# Altium schematic sheet ir_distance_display.SchDoc
size A4; DocumentNumber: 1; Revision: 0.1; SheetNumber: 1; SheetTotal: 1; HTL_Gruppe: 5; HTL_Klasse: 3AHEL; HTL_Zusaetzlicher_Titel: Empfänger und Anzeige; HTL_Schueler_Name: Hannah Purner, Philipp Doná; PageSetup: Record=PageOptions|CenterHorizontal=True|CenterVertical=True|PrintScale=1.00|XCorrection=1.00|YCorrection=1.00|PrintKind=0|BorderSize=5000000|LeftOffset=0|BottomOffset=0|Orientation=2|PaperLength=1000|PaperWidth=1000|Scale=100|PaperSource=7|PrintQuality=-4|MediaType=1|DitherType=10|PaperKind=A4|PrintScaleMode=1; HTL_Projektname: IR-DIstanz-Indikator; HTL_Dokumentenart: Schaltplan; HTL_Dokumentenstatus: Entwurf; SPICEModelCacheWMBXHUEL: <root> / <DocumentId>WMBXHUEL</DocumentId> / <CacheFrame Number="0"> / <Model Name="lm324" Kind="CKT"> / <Text>*////////////////////////////////////////////////////////// / *LM324 Low Power Quad OPERATIONAL AMPLIFIER MACRO-MODEL / *////////////////////////////////////////////////////////// / * / * connections:      non-inverting input / *                   |   inverting input / *                   |   |   positive power supply / *                   |   |   |   negative power supply / *                   |   |   |   |   output / *                   |   |   |   |   | / *                   |   |   |   |   | / .SUBCKT LM324       1   2  99  50  28 / * / * PINOUT ORDER +IN -IN V+ V- OUT / * / * / *Features: / *Eliminates need for dual supplies / *Large DC voltage gain =             100dB / *High bandwidth =                     1MHz / *Low input offset voltage =            2mV / *Wide supply range =        +-1.5V to +-16V / * / *NOTE: Model is for single device only and simulated / *      supply current is 1/4 of total device current. / *      Output crossover distortion with dual supplies / *      is not modeled. / * / ****************INPUT STAGE************** / * / IOS 2 1 5N / *^Input offset current / R1 1 3 500K / R2 3 2 500K / I1 99 4 100U / R3 5 50 517 / R4 6 50 517 / Q1 5 2 4 QX / Q2 6 7 4 QX / *Fp2=1.2 MHz / C4 5 6 128.27P / * / ***********COMMON MODE EFFECT*********** / * / I2 99 50 75U / *^Quiescent supply current / EOS 7 1 POLY(1) 16 49 2E-3 1 / *Input offset voltage.^ / R8 99 49 60K / R9 49 50 60K / * / *********OUTPUT VOLTAGE LIMITING******** / V2 99 8 1.63 / D1 9 8 DX / D2 10 9 DX / V3 10 50 .635 / * / **************SECOND STAGE************** / * / EH 99 98 99 49 1 / G1 98 9 POLY(1) 5 6 0 9.8772E-4 0 .3459 / *Fp1=7.86 Hz / R5 98 9 101.2433MEG / C3 98 9 200P / * / ***************POLE STAGE*************** / * / *Fp=2 MHz / G3 98 15 9 49 1E-6 / R12 98 15 1MEG / C5 98 15 7.9577E-14 / * / *********COMMON-MODE ZERO STAGE********* / * / *Fpcm=10 KHz / G4 98 16 3 49 5.6234E-8 / L2 98 17 15.9M / R13 17 16 1K / * / **************OUTPUT STAGE************** / * / F6 50 99 POLY(1) V6 300U 1 / E1 99 23 99 15 1 / R16 24 23 17.5 / D5 26 24 DX / V6 26 22 .63V / R17 23 25 17.5 / D6 25 27 DX / V7 22 27 .63V / V5 22 21 0.27V / D4 21 15 DX / V4 20 22 0.27V / D3 15 20 DX / L3 22 28 500P / RL3 22 28 100K / * / ***************MODELS USED************** / * / .MODEL DX D(IS=1E-15) / .MODEL QX PNP(BF=1.111E3) / * / .ENDS</Text> / </Model> / <Model Name="led_grn_yel" Kind="MDL"> / <Text>*Typ RED,GREEN,YELLOW,AMBER GaAs LED: Vf=2.1V Vr=4V If=40mA trr=3uS / *LED Pinout: 1=A, 2=K / .MODEL LED_GRN_YEL D (IS=93.1P RS=42M N=4.61 BV=4 IBV=10U / + CJO=2.97P VJ=.75 M=.333 TT=4.32U)</Text> / </Model> / <Model Name="led_red" Kind="MDL"> / <Text>*Typ RED GaAs LED: Vf=1.7V Vr=4V If=40mA trr=3uS / *LED Pinout: 1=A, 2=K / .MODEL LED_RED D (IS=93.2P RS=42M N=3.73 BV=4 IBV=10U / + CJO=2.97P VJ=.75 M=.333 TT=4.32U)</Text> / </Model> / <Model Name="qbc547a" Kind="MDL"> / <Text>* / .MODEL QBC547A NPN( / +     IS=1.533E-14 / +     NF=1.002 / +     ISE=7.932E-16 / +     NE=1.436 / +     BF=178.7 / +     IKF=0.1216 / +     VAF=69.7 / +     NR=1.004 / +     ISC=8.305E-14 / +     NC=1.207 / +     BR=8.628 / +     IKR=0.1121 / +     VAR=44.7 / +     RB=1 / +     IRB=1E-06 / +     RBM=1 / +     RE=0.6395 / +     RC=0.6508 / +     XTB=0 / +     EG=1.11 / +     XTI=3 / +     CJE=1.61E-11 / +     VJE=0.4209 / +     MJE=0.3071 / +     TF=4.995E-10 / +     XTF=139 / +     VTF=3.523 / +     ITF=0.7021 / +     PTF=0 / +     CJC=4.388E-12 / +     VJC=0.2 / +     MJC=0.2793 / +     XCJC=0.6193 / +     TR=1E-32 / +     CJS=0 / +     VJS=0.75 / +     MJS=0.333 / +     FC=0.7762 )</Text> / </Model> / <Model Name="led_ir" Kind="MDL"> / <Text>*Typ INFRARED GaAs LED: Vf=1.2V Vr=5V If=40mA trr=3uS / *LED Pinout: 1=A, 2=K / .MODEL LED_IR D (IS=93.5P RS=84M N=2.63 BV=5 IBV=10U / + CJO=2.97P VJ=.75 M=.333 TT=4.32U)</Text> / </Model> / </CacheFrame> / </root>
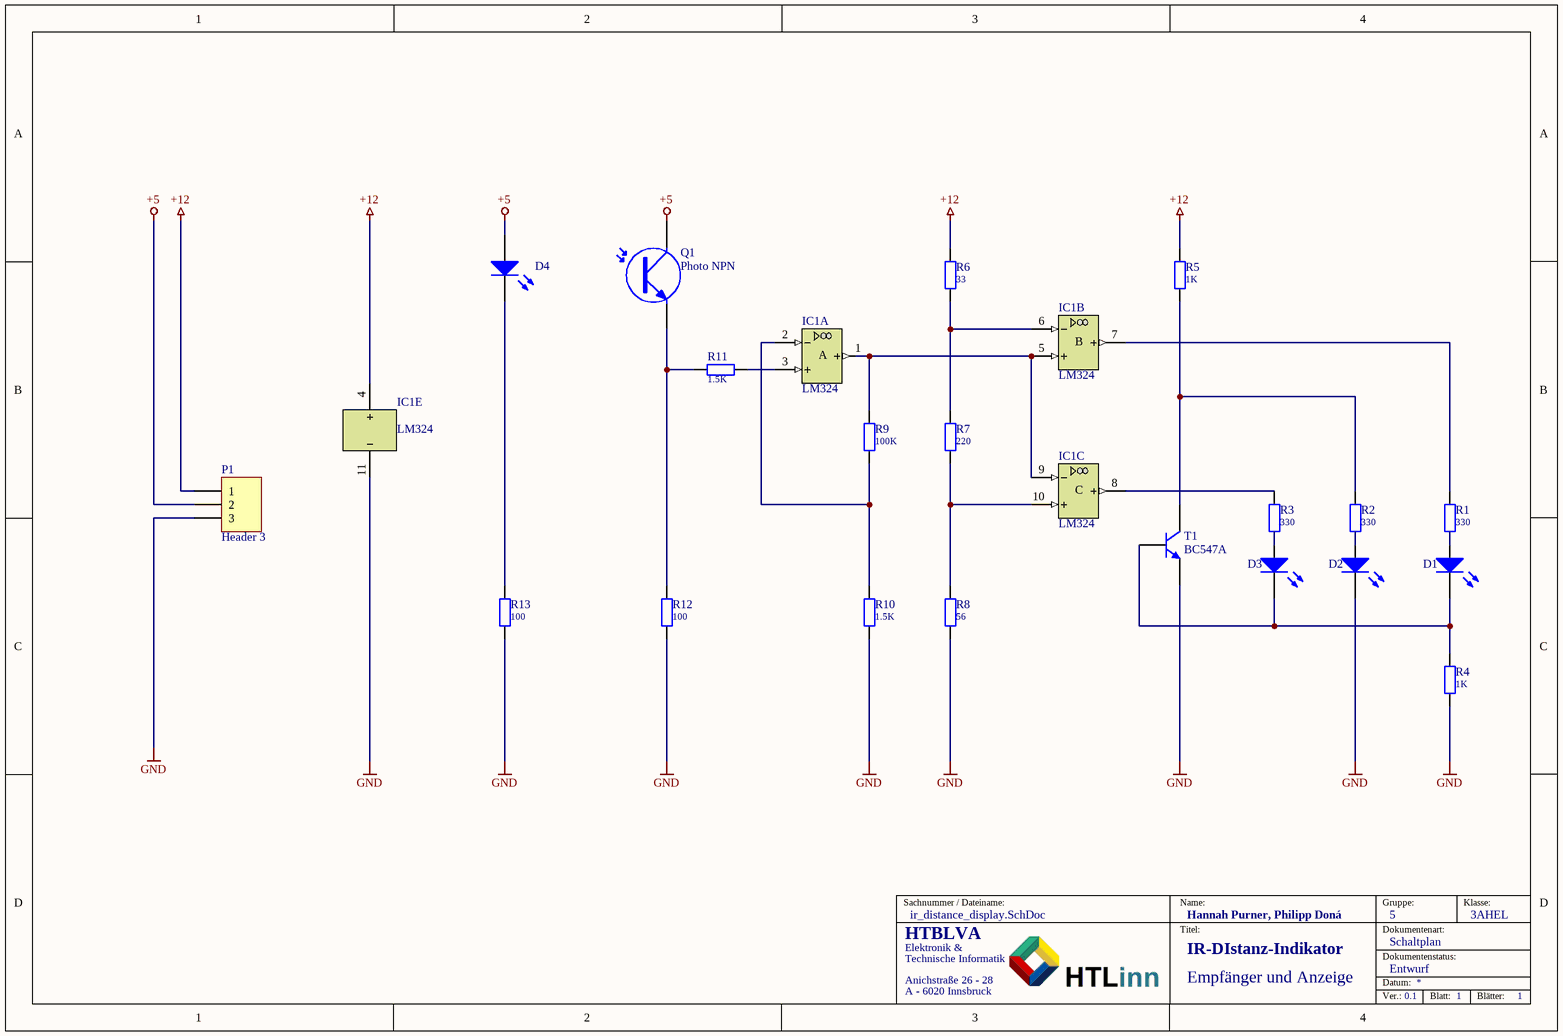
[diagram p0: ir_distance_display.SchDoc]

## Parts
D1  LED GREEN  [LED_5MM - green]  (value not drawn)
D2  LED YELLOW  [LED_5MM - yellow]  (value not drawn)
D3  LED RED  [LED_5MM - red]  (value not drawn)
D4  LED IR  [LED_5MM - clear]  (value not drawn)
IC1  LM324  [DIP14]  (parts A,B,C,E of 5)
P1  Header 3  [HDR1X3]
Q1  Photo NPN  [TO-220_A]
R1  330  [R_0207/RM4]
R2  330  [R_0207/RM4]
R3  330  [R_0207/RM4]
R4  1K  [R_0207/RM4]
R5  1K  [R_0207/RM4]
R6  33  [R_0207/RM4]
R7  220  [R_0207/RM4]
R8  56  [R_0207/RM4]
R9  100K  [R_0207/RM4]
R10  1.5K  [R_0207/RM4]
R11  1.5K  [R_0207/RM4]
R12  100  [R_0207/RM4]
R13  100  [R_0207/RM4]
T1  BC547A  [TO-92A-2]

## Nets
+5: D4.A P1.2 Q1.1(C)
+12: IC1.4(V+) P1.1 R5.1 R6.2
GND: D2.K IC1.11(V-) P1.3 R4.1 R8.1 R10.1 R12.1 R13.1 T1.1(E)
NetD1_A: D1.A R1.2
NetD1_K: D1.K D3.K R4.2 T1.2(B)
NetD2_A: D2.A R2.2
NetD3_A: D3.A R3.2
NetD4_K: D4.K R13.2
NetIC1_1: IC1.1(OUT) IC1.5(IN+) IC1.9(IN-) R9.1
NetIC1_2: IC1.2(IN-) R9.2 R10.2
NetIC1_3: IC1.3(IN+) R11.1
NetIC1_6: IC1.6(IN-) R6.1 R7.2
NetIC1_7: IC1.7(OUT) R1.1
NetIC1_8: IC1.8(OUT) R3.1
NetIC1_10: IC1.10(IN+) R7.1 R8.2
NetQ1_3: Q1.3(E) R11.2 R12.2
NetR2_1: R2.1 R5.2 T1.3(C)

## Notes on the sheet
- Sachnummer / Dateiname:
- Name:
- Gruppe:
- Klasse:
- Elektronik &
- Technische Informatik
- Anichstraße 26 - 28
- HTBLVA
- Titel:
- Datum:
- Dokumentenart:
- Dokumentenstatus:
- A - 6020 Innsbruck
- Ver.:
- Blatt:
- Blätter:
- (in symbol LM324, part A) A
- (in symbol LM324, part B) B
- (in symbol LM324, part C) C

## Library data of the parts
D1 = LED_GREEN: Green GaAs LED (Vf=2.1V, If=40mA); Usage: only permitted for non-commercial purposes at HTL I Innsbruck; SimulationModellSource: Miscellaneous Devices; Published: 21-Feb-2011; LatestRevisionDate: 01-Nov-2013
D2 = LED_YELLOW: Yellow GaAs LED (Vf=2.1V, If=40mA); Usage: only permitted for non-commercial purposes at HTL I Innsbruck; SimulationModellSource: Miscellaneous Devices; Published: 21-Feb-2011; LatestRevisionDate: 01-Nov-2013
D3 = LED_RED: Red GaAs LED (Vf=1.7V, If=40mA); Usage: only permitted for non-commercial purposes at HTL I Innsbruck; SimulationModellSource: Miscellaneous Devices; Published: 21-Feb-2011; LatestRevisionDate: 01-Nov-2013
D4 = LED_IR: Infrared GaAs LED (Vf=1.2V, If=40mA); Usage: only permitted for non-commercial purposes at HTL I Innsbruck; SimulationModellSource: Miscellaneous Devices; Published: 21-Feb-2011; LatestRevisionDate: 01-Nov-2013
IC1 = LM324: Low-Power Quad Operational Amplifier; Usage: only permitted for non-commercial purposes at HTL I Innsbruck; SimulationModellSource: ST Operational Amplifier; Published: 21-Feb-2011; LatestRevisionDate: 31-Oct-2012; Publisher: Michael Kupfner
P1 = Header 3: Header, 3-Pin; LatestRevisionDate: 17-Jul-2002; LatestRevisionNote: Re-released for DXP Platform.; Publisher: Altium Limited
Q1 = Photo NPN: NPN Phototransistor; Published: 24-Mar-1999; LatestRevisionDate: 17-Jul-2002; LatestRevisionNote: Re-released for DXP Platform.; PackageReference: TO-220_A; Publisher: Altium Limited; Code_JEDEC: TO-220-AC
R1-R13 = R: Resistor; Usage: only permitted for non-commercial purposes at HTL I Innsbruck; Published: 21-Feb-2011; LatestRevisionDate: 07-Sep-2019
  R1-R3: Value: 330
  R4 R5: Value: 1K
  R6: Value: 33
  R7: Value: 220
  R8: Value: 56
  R9: Value: 100K
  R10 R11: Value: 1.5K
  R12 R13: Value: 100
T1 = BC547A: NPN General-purpose Transistor; pin to pad: 1>3 3>1; SimulationModellSource: Philips Discrete BJT - Low Power; Usage: only permitted for non-commercial purposes at HTL I Innsbruck; Published: 21-Feb-2011; LatestRevisionDate: 31-Oct-2012